# EAGLE schematic test_board_logic3 (EAGLE 9.3.1)
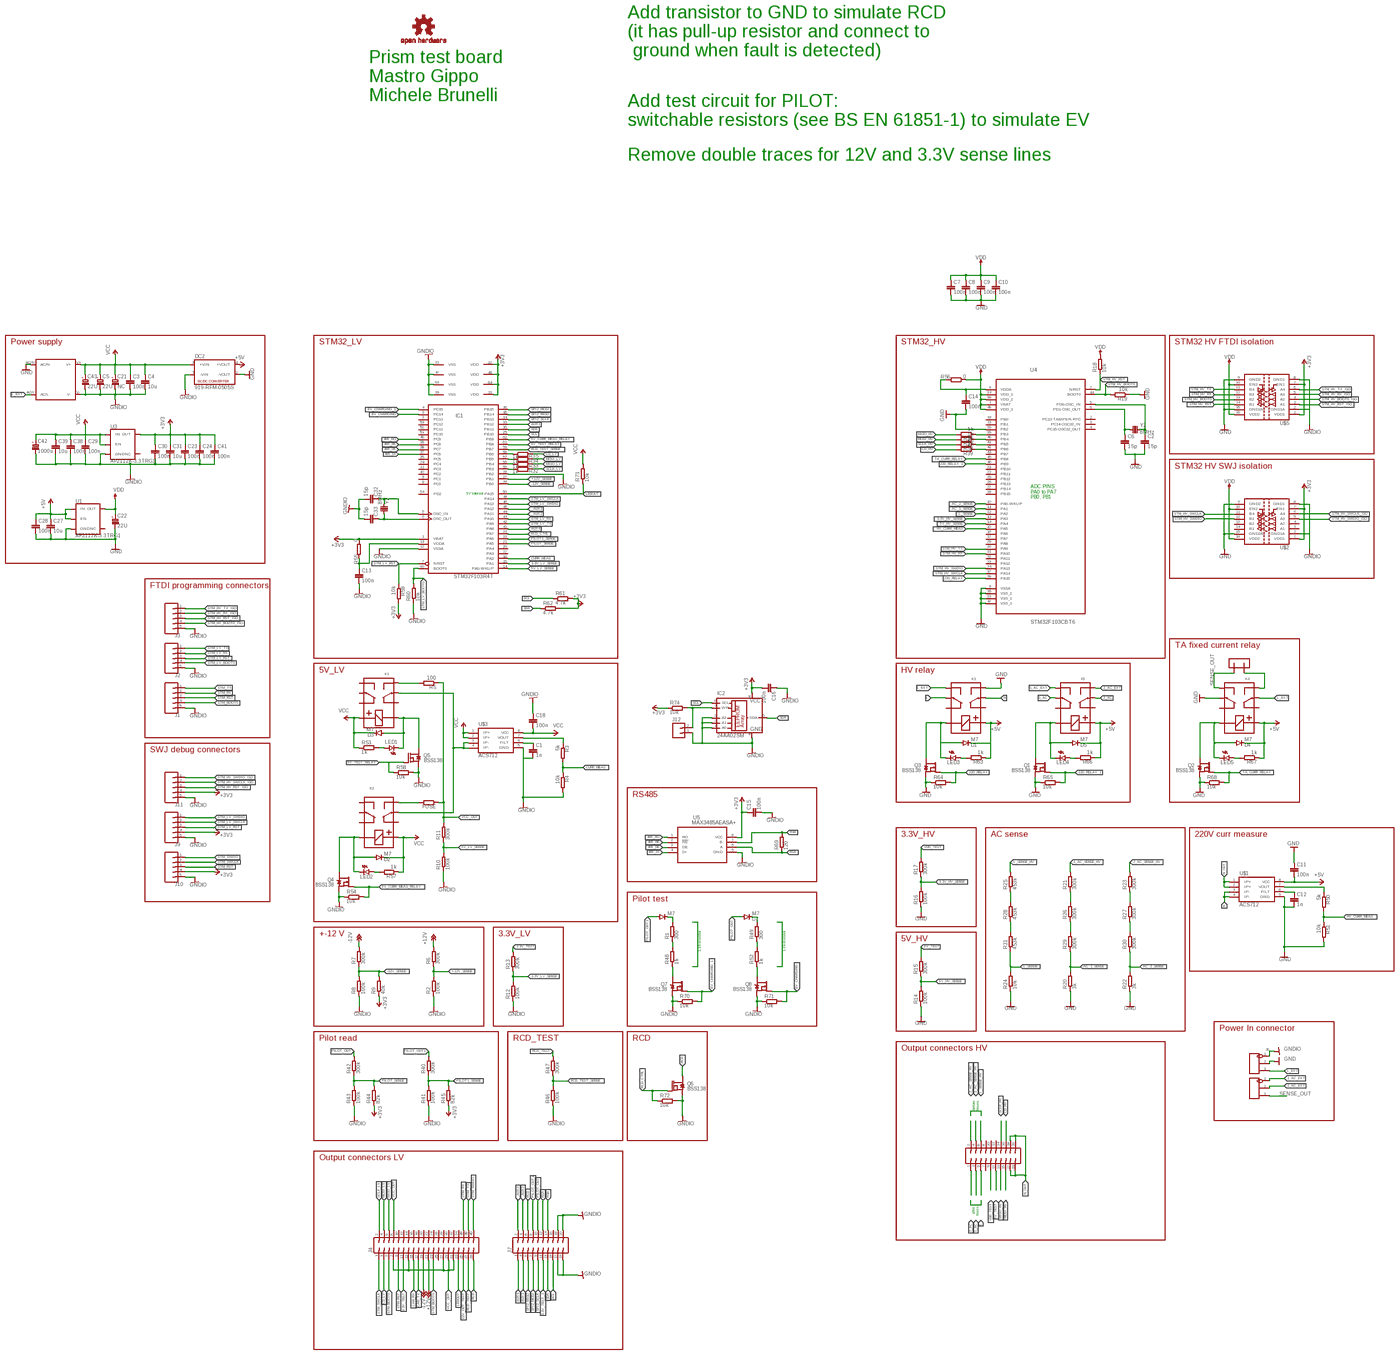
[diagram p0: schematic, sheet 1, overview]
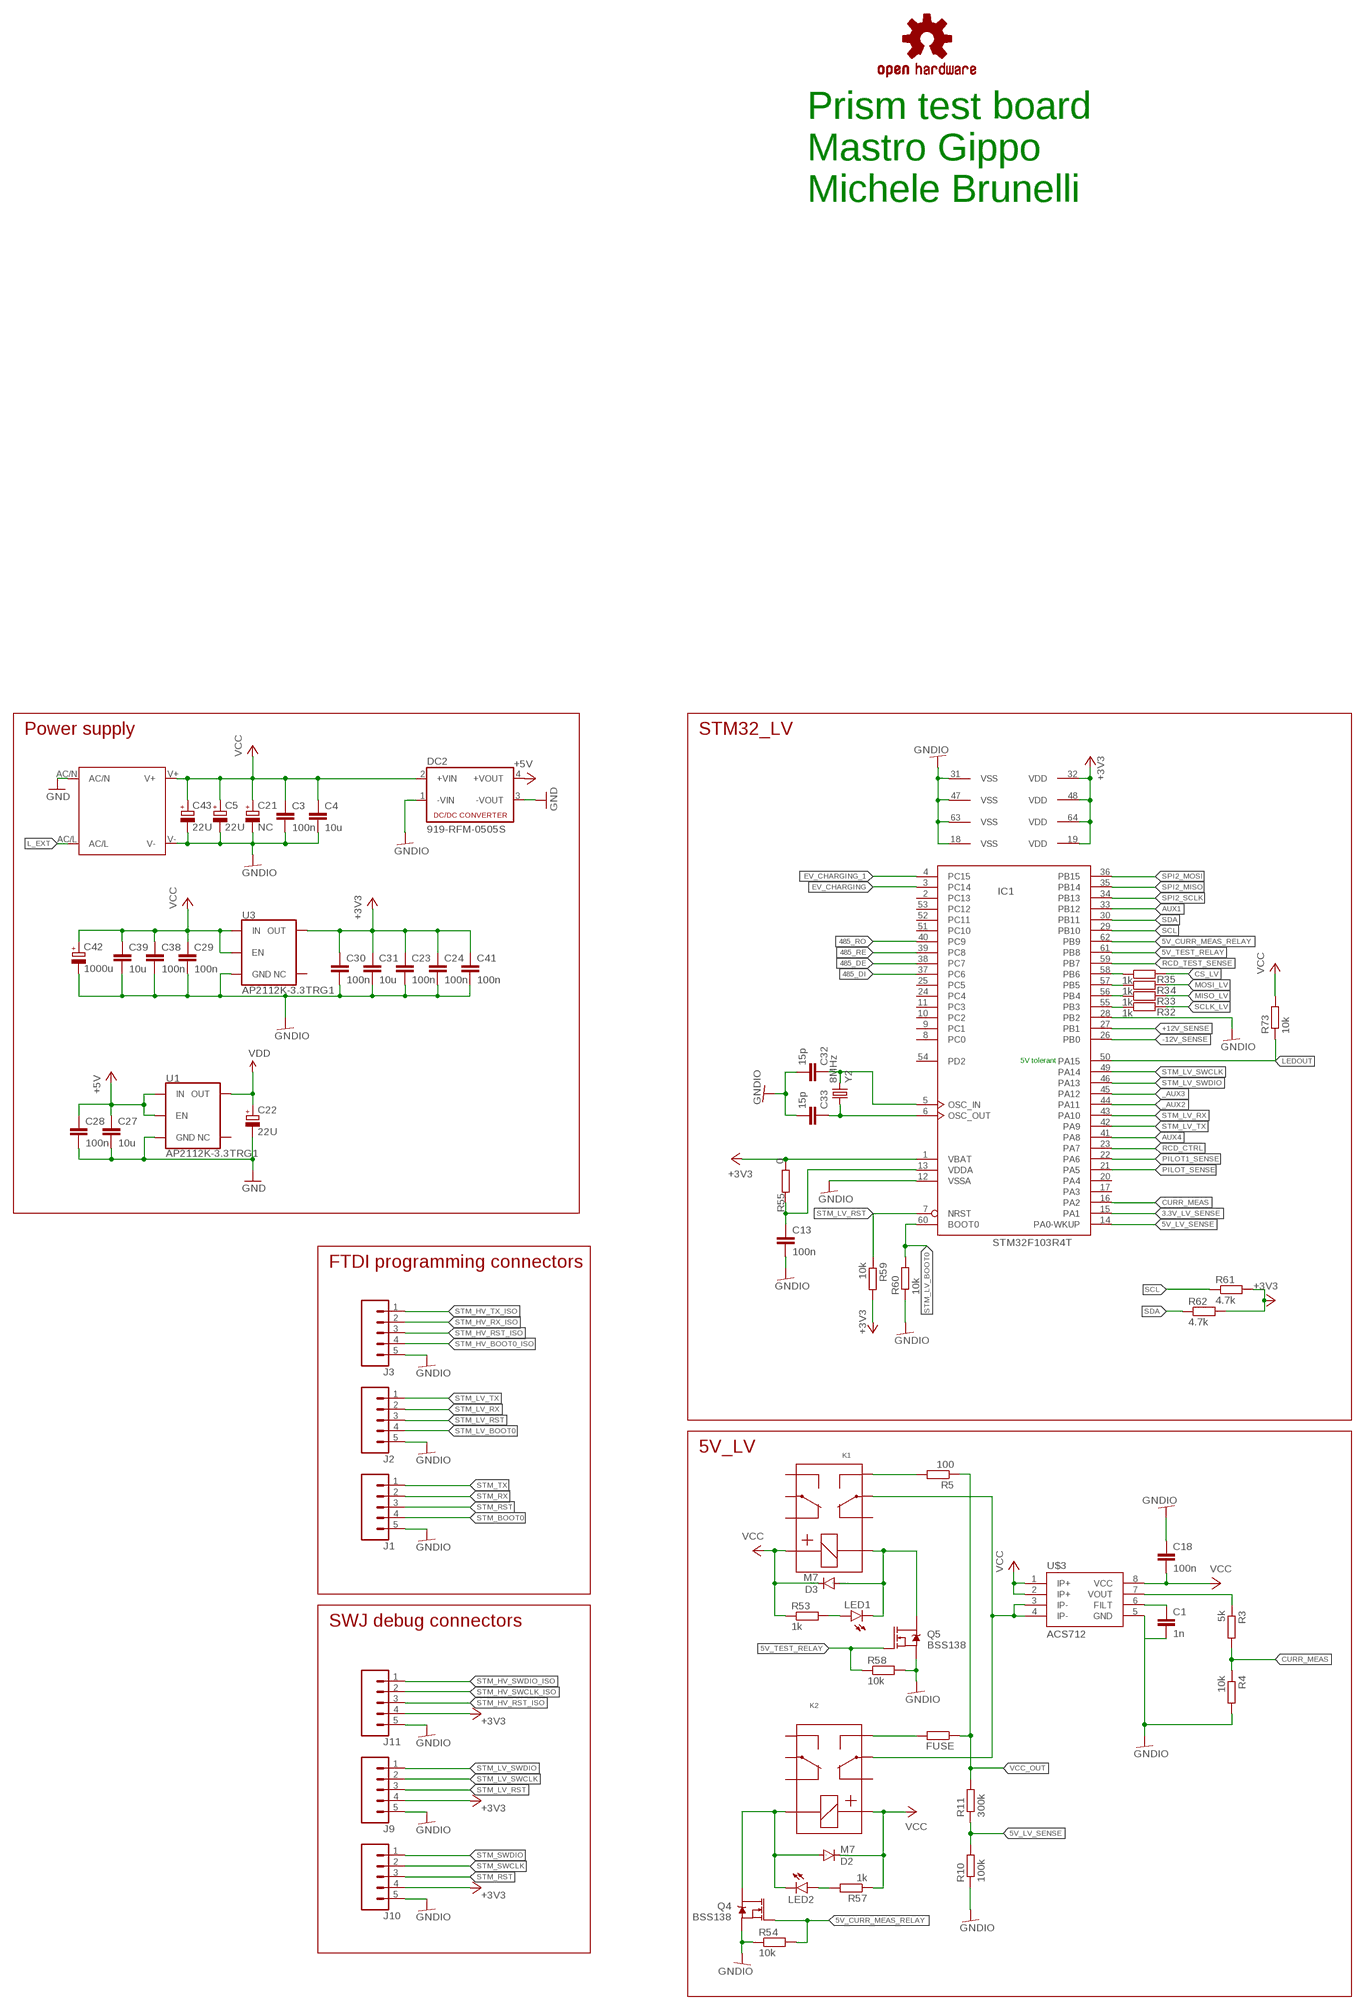
[diagram p1: schematic, sheet 1, part 1 of 4]
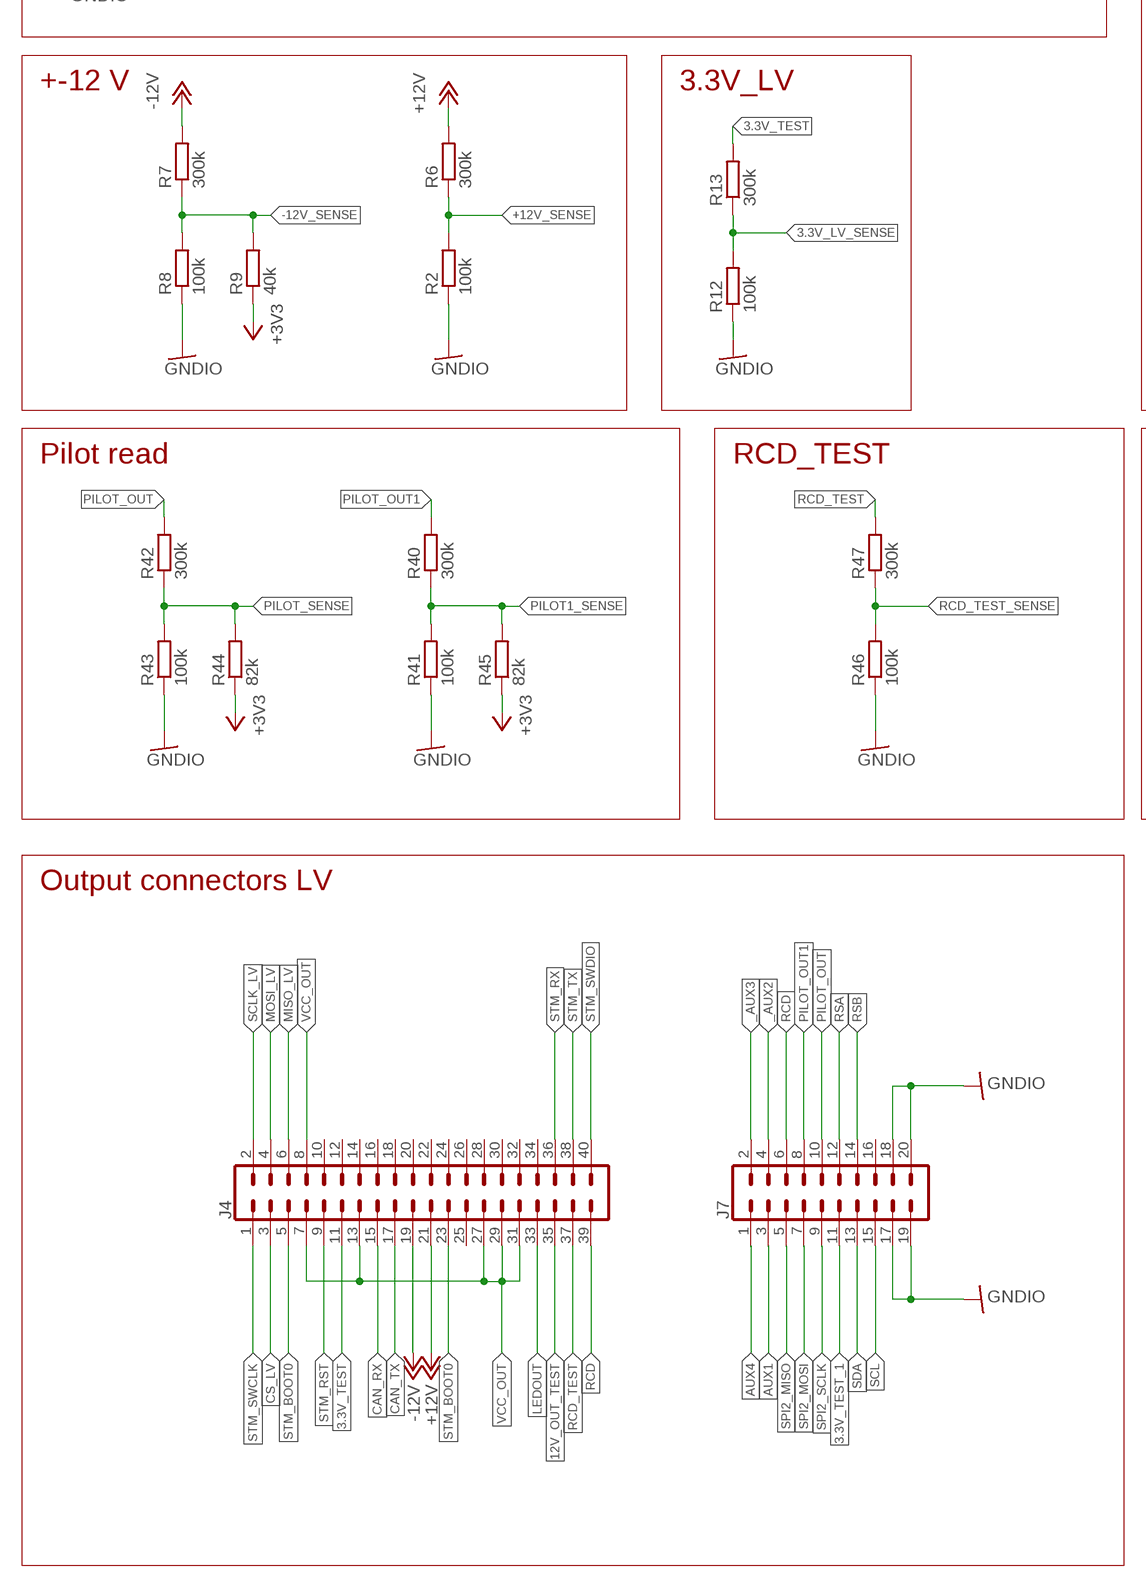
[diagram p2: schematic, sheet 1, part 2 of 4]
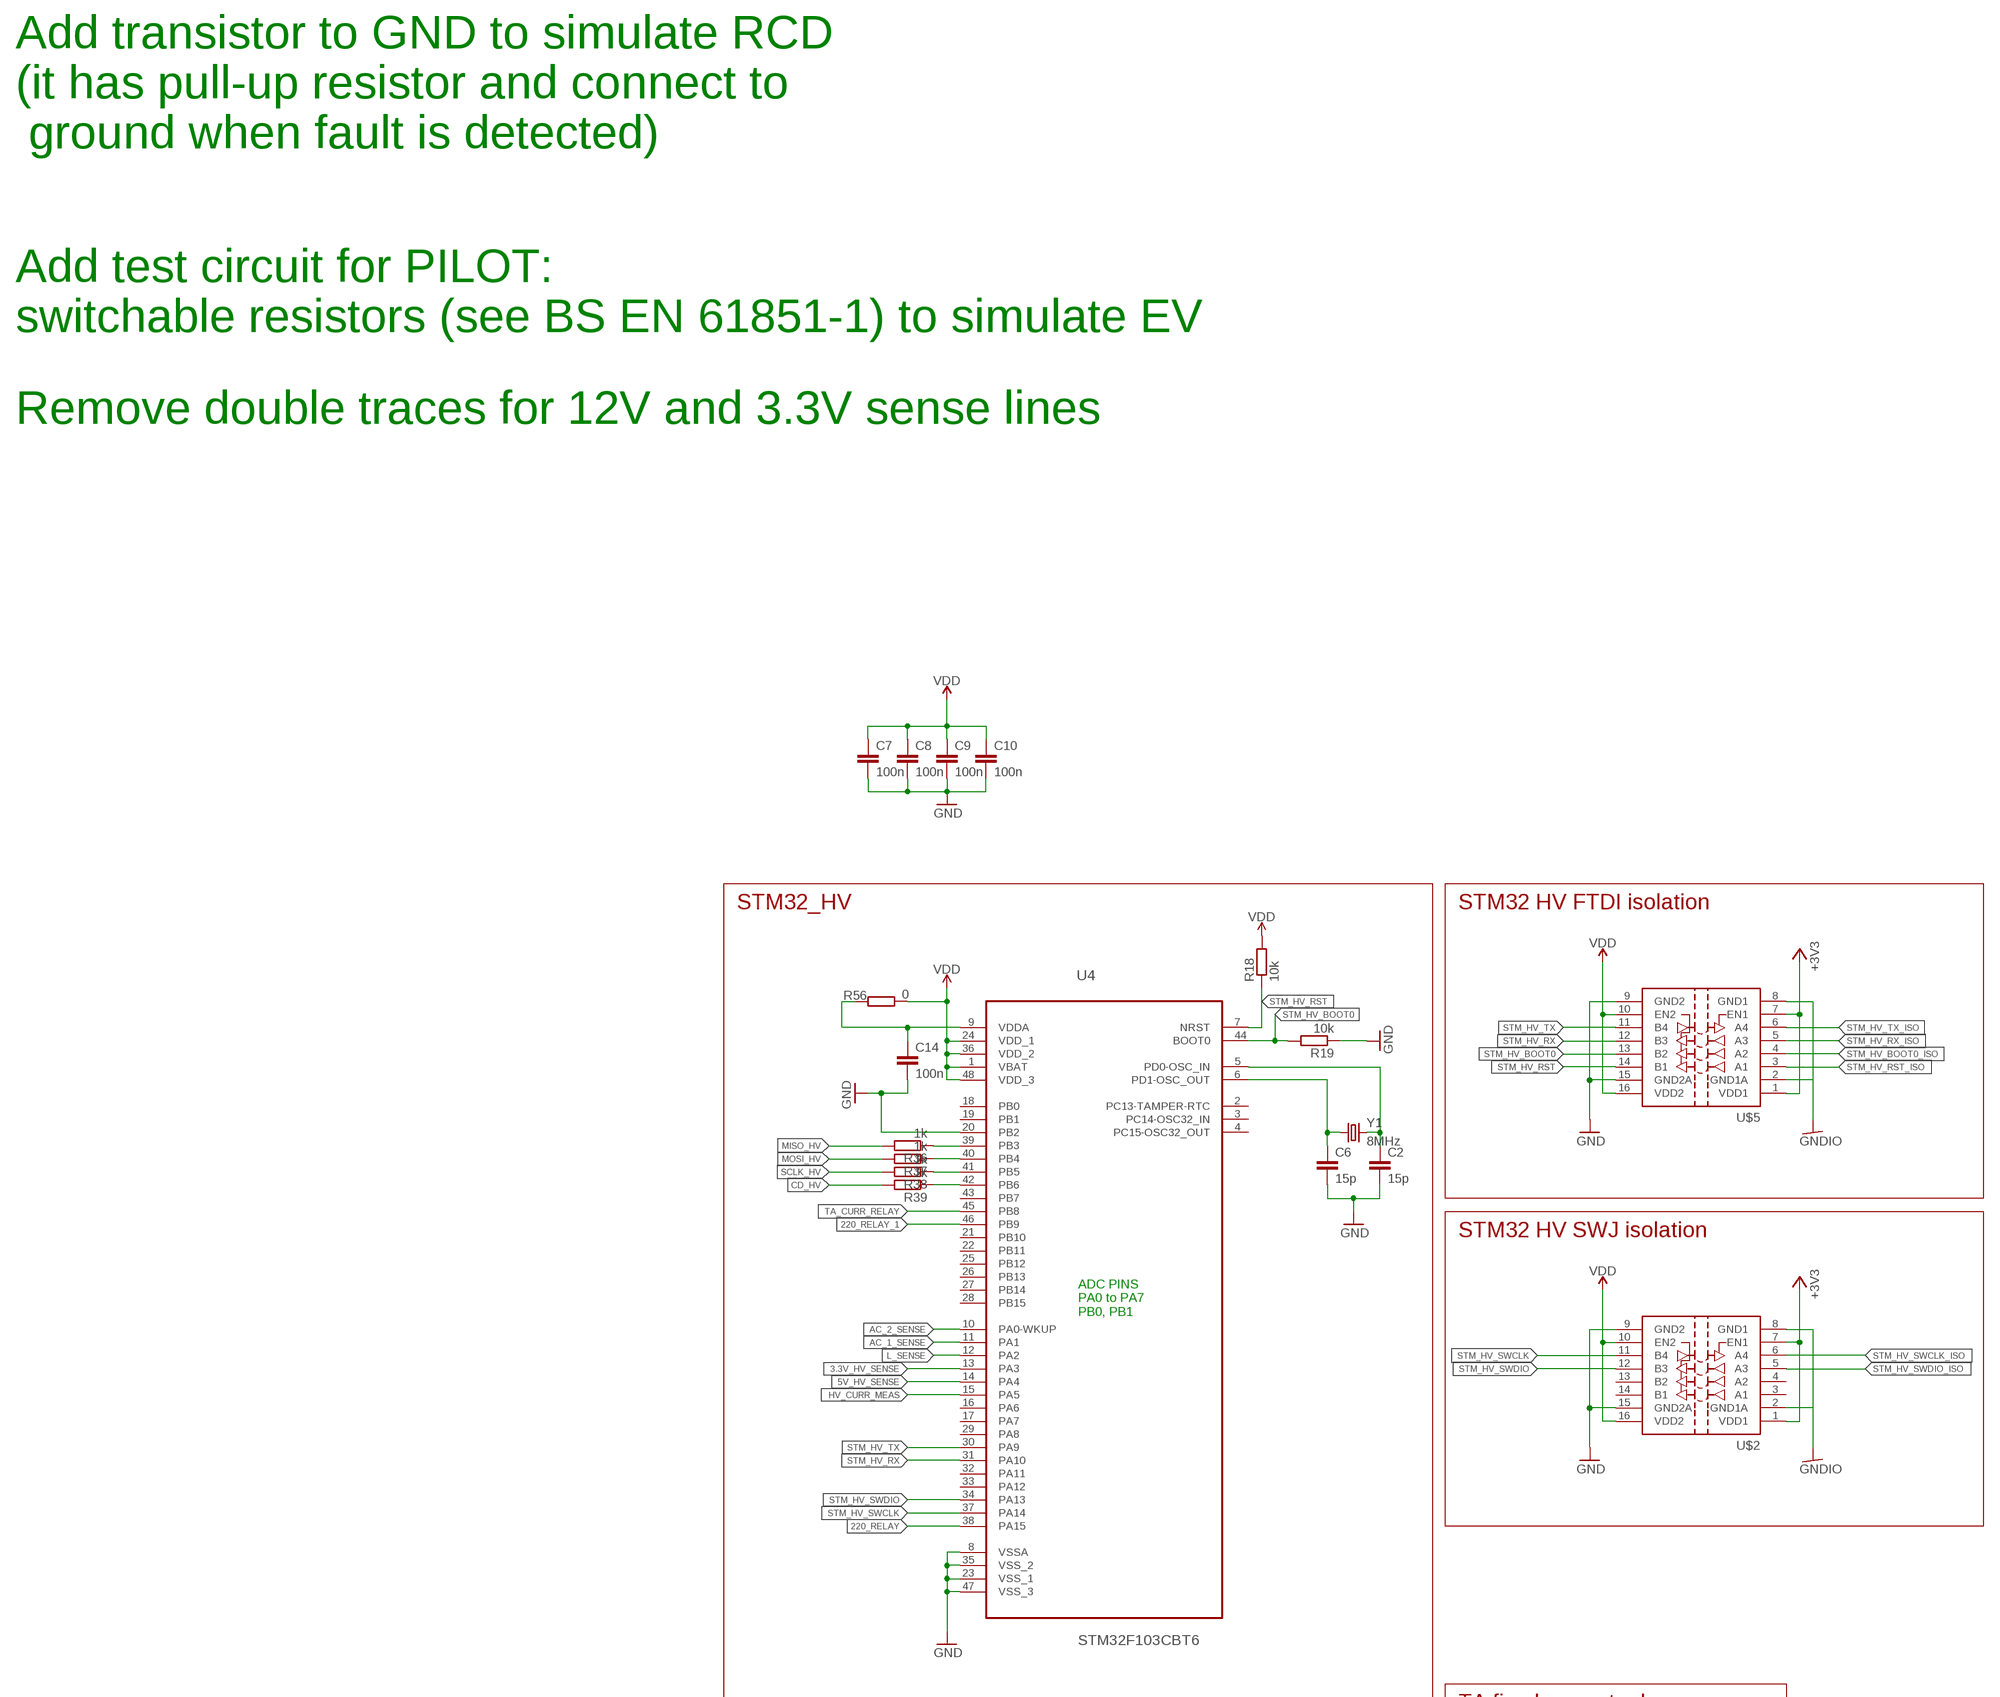
[diagram p3: schematic, sheet 1, part 3 of 4]
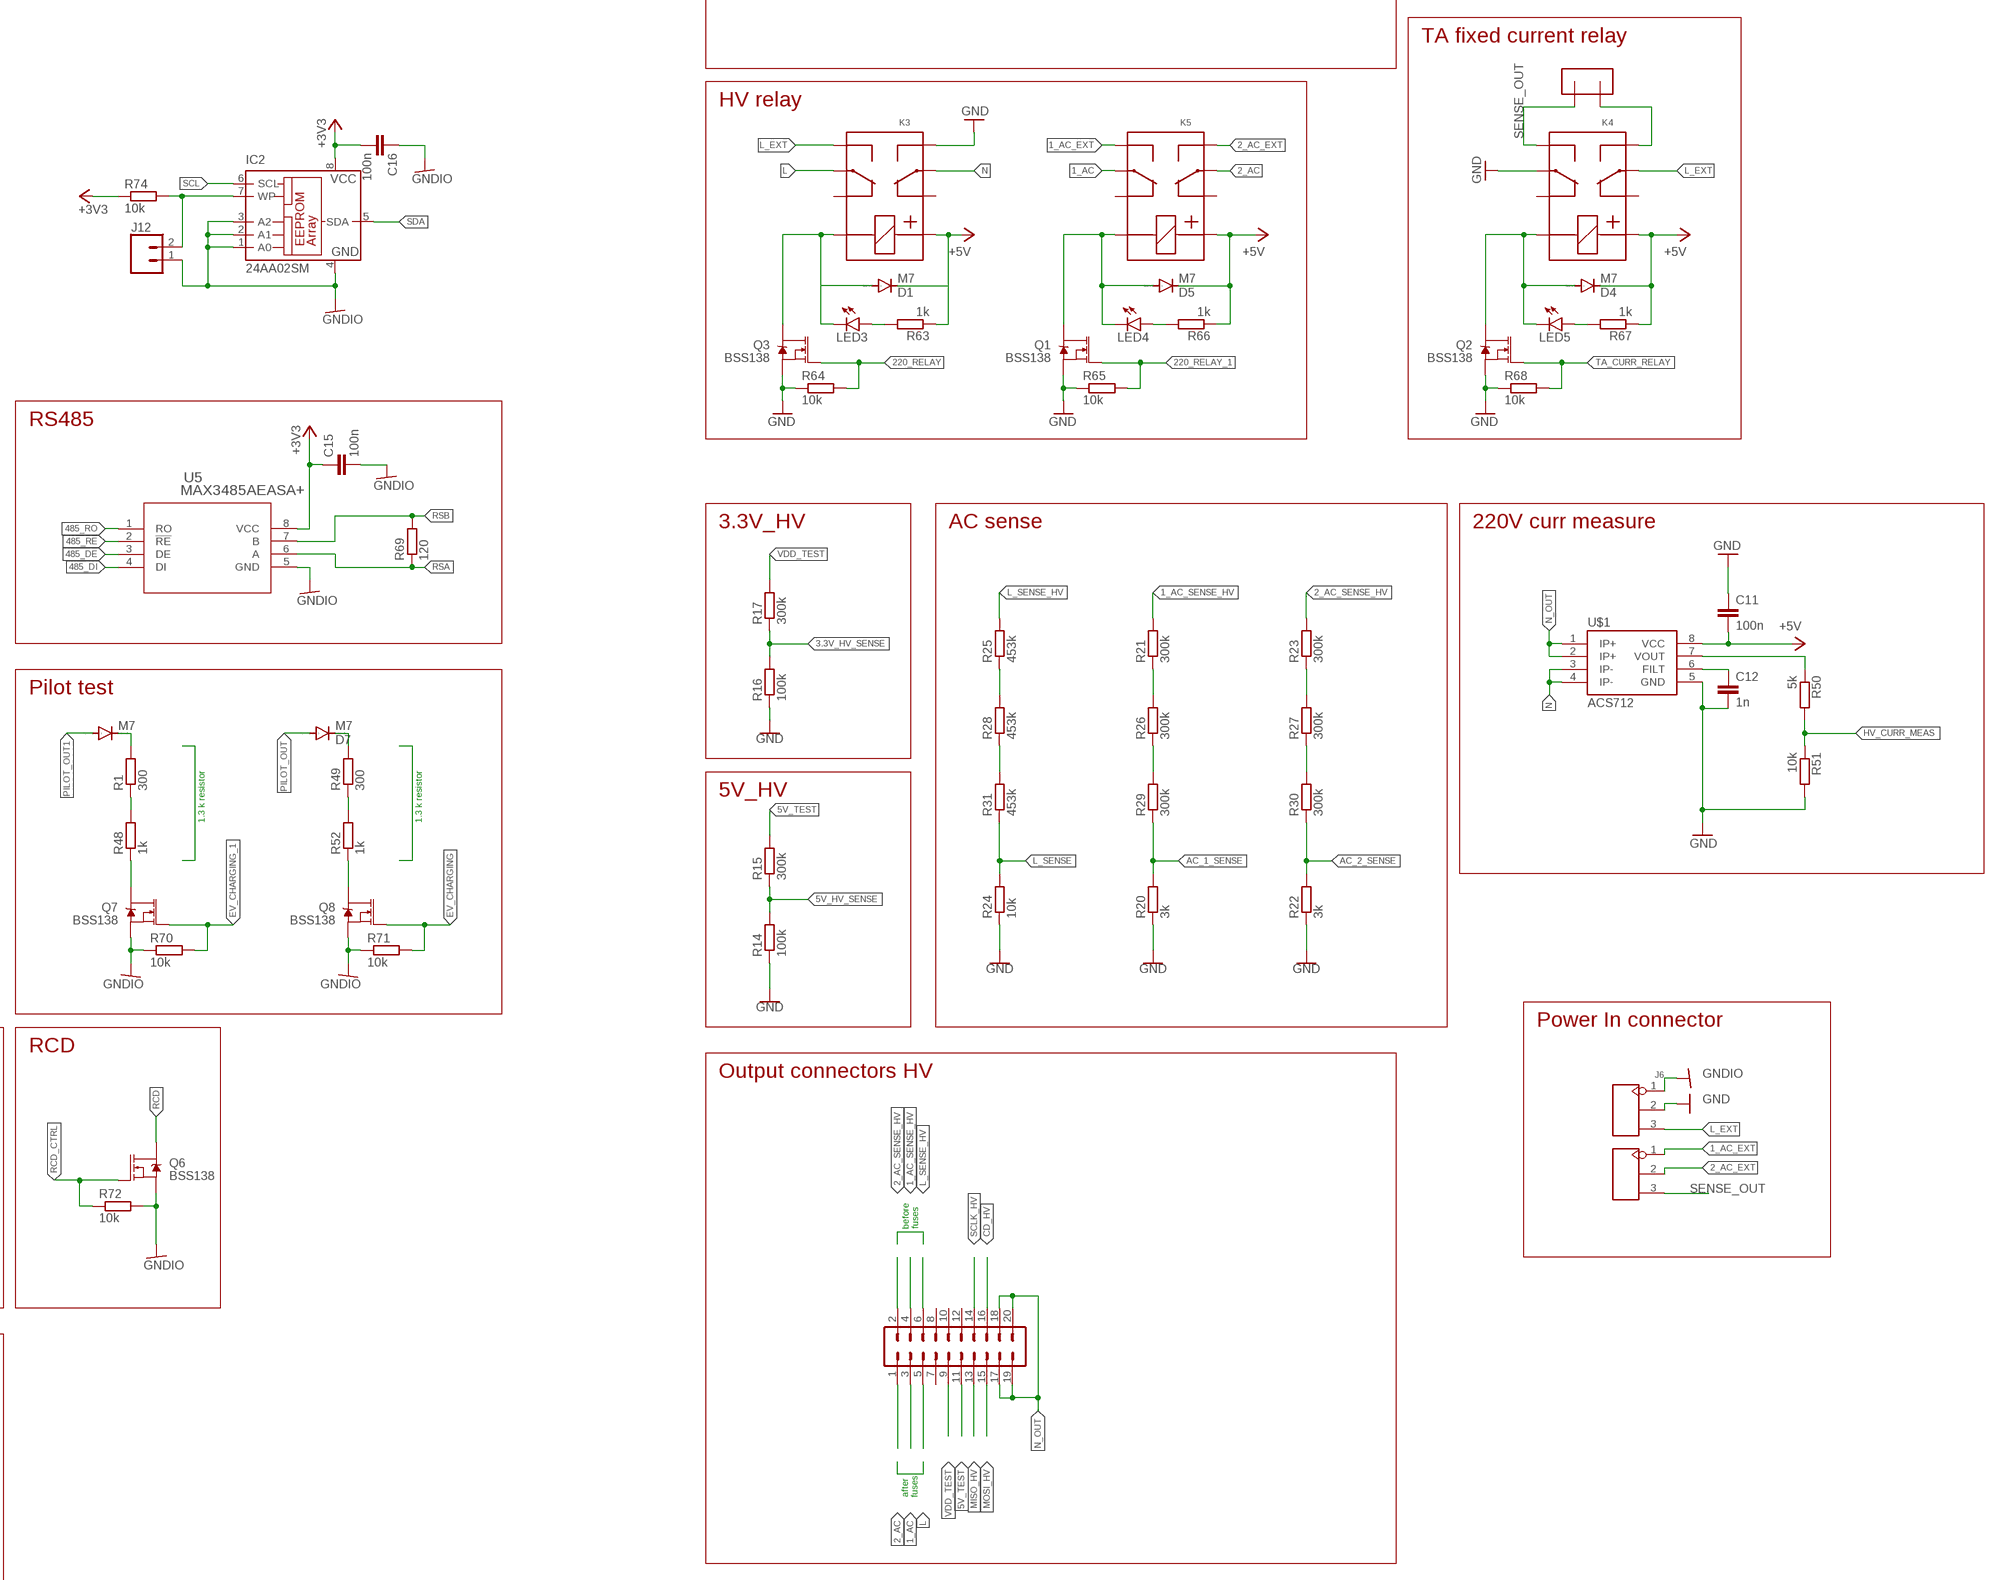
[diagram p4: schematic, sheet 1, part 4 of 4]

## Parts
C1  1n  C-EUC0603K  [C0603K]
C2  15p  C-EUC0603K  [C0603K]
C3  100n  C-EUC0603K  [C0603K]
C4  10u  C-EUC0805K  [C0805K]
C5  22U  CPOL-EUB/3528-21R  [B/3528-21R]
C6  15p  C-EUC0603K  [C0603K]
C7  100n  C-EUC0603K  [C0603K]
C8  100n  C-EUC0603K  [C0603K]
C9  100n  C-EUC0603K  [C0603K]
C10  100n  C-EUC0603K  [C0603K]
C11  100n  C-EUC0603K  [C0603K]
C12  1n  C-EUC0603K  [C0603K]
C13  100n  C-EUC0603K  [C0603K]
C14  100n  C-EUC0603K  [C0603K]
C15  100n  C-EUC0603K  [C0603K]
C16  100n  C-EUC0603K  [C0603K]
C18  100n  C-EUC0603K  [C0603K]
C21  NC  CPOL-EU153CLV-0505  [153CLV-0505]
C22  22U  CPOL-EUB/3528-21R  [B/3528-21R]
C23  100n  C-EUC0603K  [C0603K]
C24  100n  C-EUC0603K  [C0603K]
C27  10u  C-EUC0805K  [C0805K]
C28  100n  C-EUC0603K  [C0603K]
C29  100n  C-EUC0603K  [C0603K]
C30  100n  C-EUC0603K  [C0603K]
C31  10u  C-EUC0805K  [C0805K]
C32  15p  C-EUC0603K  [C0603K]
C33  15p  C-EUC0603K  [C0603K]
C38  100n  C-EUC0603K  [C0603K]
C39  10u  C-EUC0805K  [C0805K]
C41  100n  C-EUC0603K  [C0603K]
C42  1000u  CPOL-EUE5-10.5  [E5-10,5]
C43  22U  CPOL-EUB/3528-21R  [B/3528-21R]
D1  M7  DIODE-DO-214AC  [DO-214AC]
D2  M7  DIODE-DO-214AC  [DO-214AC]
D3  M7  DIODE-DO-214AC  [DO-214AC]
D4  M7  DIODE-DO-214AC  [DO-214AC]
D5  M7  DIODE-DO-214AC  [DO-214AC]
D6  M7  DIODE-DO-214AC  [DO-214AC]
D7  M7  DIODE-DO-214AC  [DO-214AC]
DC2  919-RFM-0505S  NME  [NME]
FUSE  R-EU_R0805  [R0805]
IC1  STM32F103R4T  [LQFP64]
IC2  24AA02SM  [SO-08M]
J1  2001R-5P  CONN_05JST-VERT  [JST-5-PTH-VERT]
J2  2001R-5P  CONN_05JST-VERT  [JST-5-PTH-VERT]
J3  2001R-5P  CONN_05JST-VERT  [JST-5-PTH-VERT]
J4  CONN_20X2SHROUDED  [2X20_SHROUDED]
J5  GREEN-3P-5.0  SCREW-TERMINAL-GREEN(3P-5.0)  [H3-5.0-15.5X8.0MM]
J6  GREEN-3P-5.0  SCREW-TERMINAL-GREEN(3P-5.0)  [H3-5.0-15.5X8.0MM]
J7  CONN_10X2  [2X10]
J8  CONN_10X2  [2X10]
J9  2001R-5P  CONN_05JST-VERT  [JST-5-PTH-VERT]
J10  2001R-5P  CONN_05JST-VERT  [JST-5-PTH-VERT]
J11  2001R-5P  CONN_05JST-VERT  [JST-5-PTH-VERT]
J12  CONN_02  [1X02]
K1  G6S-2  [G6S-2]
K2  G6S-2  [G6S-2]
K3  G6S-2  [G6S-2]
K4  G6S-2  [G6S-2]
K5  G6S-2  [G6S-2]
LED1  LEDSMT1206  [1206]
LED2  LEDSMT1206  [1206]
LED3  LEDSMT1206  [1206]
LED4  LEDSMT1206  [1206]
LED5  LEDSMT1206  [1206]
Q1  BSS138  MOSFET-NCH-BSS138  [SOT23-3]
Q2  BSS138  MOSFET-NCH-BSS138  [SOT23-3]
Q3  BSS138  MOSFET-NCH-BSS138  [SOT23-3]
Q4  BSS138  MOSFET-NCH-BSS138  [SOT23-3]
Q5  BSS138  MOSFET-NCH-BSS138  [SOT23-3]
Q6  BSS138  MOSFET-NCH-BSS138  [SOT23-3]
Q7  BSS138  MOSFET-NCH-BSS138  [SOT23-3]
Q8  BSS138  MOSFET-NCH-BSS138  [SOT23-3]
R1  300  R-EU_R0603  [R0603]
R2  100k  R-EU_R0603  [R0603]
R3  5k  R-EU_R0603  [R0603]
R4  10k  R-EU_R0603  [R0603]
R5  100  R-EU_R1210  [R1210]
R6  300k  R-EU_R0603  [R0603]
R7  300k  R-EU_R0603  [R0603]
R8  100k  R-EU_R0603  [R0603]
R9  40k  R-EU_R0603  [R0603]
R10  100k  R-EU_R0603  [R0603]
R11  300k  R-EU_R0603  [R0603]
R12  100k  R-EU_R0603  [R0603]
R13  300k  R-EU_R0603  [R0603]
R14  100k  R-EU_R0603  [R0603]
R15  300k  R-EU_R0603  [R0603]
R16  100k  R-EU_R0603  [R0603]
R17  300k  R-EU_R0603  [R0603]
R18  10k  R-EU_R0603  [R0603]
R19  10k  R-EU_R0603  [R0603]
R20  3k  R-EU_R0603  [R0603]
R21  300k  R-EU_R0603  [R0603]
R22  3k  R-EU_R0603  [R0603]
R23  300k  R-EU_R0603  [R0603]
R24  10k  R-EU_R0603  [R0603]
R25  453k  R-EU_R0603  [R0603]
R26  300k  R-EU_R0603  [R0603]
R27  300k  R-EU_R0603  [R0603]
R28  453k  R-EU_R0603  [R0603]
R29  300k  R-EU_R0603  [R0603]
R30  300k  R-EU_R0603  [R0603]
R31  453k  R-EU_R0603  [R0603]
R32  1k  R-EU_R0603  [R0603]
R33  1k  R-EU_R0603  [R0603]
R34  1k  R-EU_R0603  [R0603]
R35  1k  R-EU_R0603  [R0603]
R36  1k  R-EU_R0603  [R0603]
R37  1k  R-EU_R0603  [R0603]
R38  1k  R-EU_R0603  [R0603]
R39  1k  R-EU_R0603  [R0603]
R40  300k  R-EU_R0603  [R0603]
R41  100k  R-EU_R0603  [R0603]
R42  300k  R-EU_R0603  [R0603]
R43  100k  R-EU_R0603  [R0603]
R44  82k  R-EU_R0603  [R0603]
R45  82k  R-EU_R0603  [R0603]
R46  100k  R-EU_R0603  [R0603]
R47  300k  R-EU_R0603  [R0603]
R48  1k  R-EU_R0603  [R0603]
R49  300  R-EU_R0603  [R0603]
R50  5k  R-EU_R0603  [R0603]
R51  10k  R-EU_R0603  [R0603]
R52  1k  R-EU_R0603  [R0603]
R53  1k  R-EU_R0603  [R0603]
R54  10k  R-EU_R0603  [R0603]
R55  0  R-EU_R0603  [R0603]
R56  0  R-EU_R0603  [R0603]
R57  1k  R-EU_R0603  [R0603]
R58  10k  R-EU_R0603  [R0603]
R59  10k  R-EU_R0603  [R0603]
R60  10k  R-EU_R0603  [R0603]
R61  4.7k  R-EU_R0603  [R0603]
R62  4.7k  R-EU_R0603  [R0603]
R63  1k  R-EU_R0603  [R0603]
R64  10k  R-EU_R0603  [R0603]
R65  10k  R-EU_R0603  [R0603]
R66  1k  R-EU_R0603  [R0603]
R67  1k  R-EU_R0603  [R0603]
R68  10k  R-EU_R0603  [R0603]
R69  120  R-EU_R0603  [R0603]
R70  10k  R-EU_R0603  [R0603]
R71  10k  R-EU_R0603  [R0603]
R72  10k  R-EU_R0603  [R0603]
R73  10k  R-EU_R0603  [R0603]
R74  10k  R-EU_R0603  [R0603]
U1  AP2112K-3.3TRG1  V_REG_AP2112K-3.3V  [SOT23-5]
U3  AP2112K-3.3TRG1  V_REG_AP2112K-3.3V  [SOT23-5]
U4  STM32F103CBT6  [QFP50P900X900X160-48N]
U5  MAX3485AEASA+  [21-0041B_8]
U$1  ACS712  [SO08]
U$2  SI8441IS1  [SO16]
U$3  ACS712  [SO08]
U$4  NC  IRM_15/20IRM_15/20  [IRM_15/20]
U$5  SI8441IS1  [SO16]
U$6  2 PIN STRIP F  ISOLATED_2P  [STRIP_NOMIDDLE]
U$7  OSHW-LOGOL  [OSHW-LOGO-L]
Y1  8MHz  CRYSTALSMD-3.2X2.5  [CRYSTAL-SMD-3.2X2.5MM]
Y2  8MHz  CRYSTALSMD-3.2X2.5  [CRYSTAL-SMD-3.2X2.5MM]

## Nets
1_AC: J8.3 K5.9
1_AC1: R21.1 R26.2
1_AC2: R26.1 R29.2
1_AC_EXT: J5.1 K5.8
1_AC_SENSE_HV: J8.4 R21.2
2_AC: J8.1 K5.4
2_AC1: R23.1 R27.2
2_AC2: R27.1 R30.2
2_AC_EXT: J5.2 K5.5
2_AC_SENSE_HV: J8.2 R23.2
3.3V_HV_SENSE: R16.2 R17.1 U4.13(PA3)
3.3V_LV_SENSE: IC1.15(PA1) R12.2 R13.1
3.3V_TEST: J4.11 R13.2
3.3V_TEST_1: J7.11
5V_CURR_MEAS_RELAY: IC1.62(PB9) Q4.1(G) R54.2
5V_HV_SENSE: R14.2 R15.1 U4.14(PA4)
5V_LV_SENSE: IC1.14(PA0-WKUP) R10.2 R11.1
5V_TEST: J8.11 R15.2
5V_TEST_RELAY: IC1.61(PB8) Q5.1(G) R58.1
12V_OUT_TEST: J4.35
220_RELAY: Q3.1(G) R64.2 U4.38(PA15)
220_RELAY_1: Q1.1(G) R65.2 U4.46(PB9)
485_DE: IC1.38(PC7) U5.3(DE)
485_DI: IC1.37(PC6) U5.4(DI)
485_RE: IC1.39(PC8) U5.2(!RE)
485_RO: IC1.40(PC9) U5.1(RO)
+3V3: C15.1 C16.2 C23.1 C24.1 C30.1 C31.1 C41.1 IC1.1(VBAT) IC1.19(VDD) IC1.32(VDD) IC1.48(VDD) IC1.64(VDD) IC2.8(VCC) J9.4 J10.4 J11.4 R9.1 R44.1 R45.1 R55.1 R59.2 R61.2 R62.2 R74.1 U3.5(OUT) U5.8(VCC) U$2.1(VDD1) U$2.7(EN1) U$5.1(VDD1) U$5.7(EN1)
+5V: C11.2 C27.1 C28.1 D1.C D4.C D5.C DC2.4(+VOUT) K3.1 K4.1 K5.1 R63.1 R66.1 R67.1 U1.1(IN) U1.3(EN) U$1.8(VCC)
+12V: J4.21 R6.2
+12V_SENSE: IC1.27(PB1) R2.2 R6.1
-12V: J4.19 R7.2
-12V_SENSE: IC1.26(PB0) R7.1 R8.2 R9.2
_AUX2: IC1.44(PA11) J7.4
_AUX3: IC1.45(PA12) J7.2
AC_1_SENSE: R20.2 R29.1 U4.11(PA1)
AC_2_SENSE: R22.2 R30.1 U4.10(PA0-WKUP)
AUX1: IC1.33(PB12) J7.3
AUX4: IC1.41(PA8) J7.1
CAN_RX: J4.15
CAN_TX: J4.17
CD_HV: J8.16 R39.2
CS_LV: J4.3 R35.2
CURR_MEAS: IC1.16(PA2) R3.2 R4.1
EV_CHARGING: IC1.3(PC14) Q8.1(G) R71.2
EV_CHARGING_1: IC1.4(PC15) Q7.1(G) R70.2
GND: C2.2 C6.2 C7.2 C8.2 C9.2 C10.2 C11.1 C12.2 C14.2 C22.- C27.2 C28.2 DC2.3(-VOUT) J6.2 K3.5 K4.9 Q1.2(S) Q2.2(S) Q3.2(S) R14.1 R16.1 R19.1 R20.1 R22.1 R24.1 R51.2 R64.1 R65.1 R68.1 U1.2(GND) U4.8(VSSA) U4.20(PB2) U4.23(VSS_1) U4.35(VSS_2) U4.47(VSS_3) U$1.5(GND) U$2.9(GND2) U$2.15(GND2A) U$4.AC/N U$5.9(GND2) U$5.15(GND2A)
GNDIO: C1.2 C3.2 C4.2 C5.- C13.2 C15.2 C16.1 C18.1 C21.- C23.2 C24.2 C29.2 C30.2 C31.2 C32.2 C33.2 C38.2 C39.2 C41.2 C42.- C43.- DC2.1(-VIN) IC1.12(VSSA) IC1.18(VSS) IC1.28(PB2) IC1.31(VSS) IC1.47(VSS) IC1.63(VSS) IC2.1(A0) IC2.2(A1) IC2.3(A2) IC2.4(GND) J1.5 J2.5 J3.5 J6.1 J7.17 J7.18 J7.19 J7.20 J9.5 J10.5 J11.5 J12.1 Q4.2(S) Q5.2(S) Q6.2(S) Q7.2(S) Q8.2(S) R2.1 R4.2 R8.1 R10.1 R12.1 R41.1 R43.1 R46.1 R54.1 R58.2 R60.1 R70.1 R71.1 R72.2 U3.2(GND) U5.5(GND) U$2.2(GND1A) U$2.8(GND1) U$3.5(GND) U$4.V- U$5.2(GND1A) U$5.8(GND1)
HV_CURR_MEAS: R50.2 R51.1 U4.15(PA5)
L: J8.5 K3.9
L1: R25.1 R28.2
L2: R28.1 R31.2
L_EXT: J6.3 K3.8 K4.4 U$4.AC/L
L_SENSE: R24.2 R31.1 U4.12(PA2)
L_SENSE_HV: J8.6 R25.2
LEDOUT: IC1.50(PA15) J4.33 R73.1
MISO_HV: J8.13 R36.2
MISO_LV: J4.6 R33.2
MOSI_HV: J8.15 R37.2
MOSI_LV: J4.4 R34.2
N: K3.4 U$1.3(IP-) U$1.4(IP-)
N$1: R3.1 U$3.7(VOUT)
N$2: FUSE.2 K2.5
N$3: IC2.7(WP) J12.2 R74.2
N$4: C2.1 U4.5(PD0-OSC_IN) Y1.3
N$5: C1.1 U$3.6(FILT)
N$6: IC1.55(PB3) R32.1
N$7: C6.1 U4.6(PD1-OSC_OUT) Y1.1
N$8: K1.8 R5.2
N$9: IC1.56(PB4) R33.1
N$10: K1.9 K2.4 U$3.3(IP-) U$3.4(IP-)
N$11: C33.1 IC1.6(OSC_OUT) Y2.1
N$12: IC1.57(PB5) R34.1
N$13: IC1.58(PB6) R35.1
N$14: R36.1 U4.39(PB3)
N$15: R37.1 U4.40(PB4)
N$16: R38.1 U4.41(PB5)
N$17: R39.1 U4.42(PB6)
N$18: C12.1 U$1.6(FILT)
N$21: D4.A K4.12 LED5.C Q2.3(D)
N$22: R50.1 U$1.7(VOUT)
N$23: K4.5 U$6.P$1
N$24: D1.A K3.12 LED3.C Q3.3(D)
N$25: D5.A K5.12 LED4.C Q1.3(D)
N$26: D2.A K2.12 LED2.C Q4.3(D)
N$27: D3.A K1.12 LED1.C Q5.3(D)
N$28: C13.1 IC1.13(VDDA) R55.2
N$29: C14.1 R56.2 U4.9(VDDA)
N$30: D6.C R1.2
N$31: Q7.3(D) R48.1
N$32: R49.1 R52.2
N$34: Q8.3(D) R52.1
N$36: R1.1 R48.2
N$37: LED1.A R53.2
N$38: LED5.A R67.2
N$39: LED2.A R57.2
N$40: LED3.A R63.2
N$42: LED4.A R66.2
N$43: D7.C R49.2
N$44: C32.1 IC1.5(OSC_IN) Y2.3
N_OUT: J8.17 J8.18 J8.19 J8.20 U$1.1(IP+) U$1.2(IP+)
PILOT1_SENSE: IC1.22(PA6) R40.1 R41.2 R45.2
PILOT_OUT: D7.A J7.10 R42.2
PILOT_OUT1: D6.A J7.8 R40.2
PILOT_SENSE: IC1.21(PA5) R42.1 R43.2 R44.2
RCD: J4.39 J7.6 Q6.3(D)
RCD_CTRL: IC1.23(PA7) Q6.1(G) R72.1
RCD_TEST: J4.37 R47.2
RCD_TEST_SENSE: IC1.59(PB7) R46.2 R47.1
RSA: J7.12 R69.1 U5.6(A)
RSB: J7.14 R69.2 U5.7(B)
SCL: IC1.29(PB10) IC2.6(SCL) J7.15 R61.1
SCLK_HV: J8.14 R38.2
SCLK_LV: J4.2 R32.2
SDA: IC1.30(PB11) IC2.5(SDA) J7.13 R62.1
SENSE_OUT: J5.3 K4.8 U$6.P$2
SPI2_MISO: IC1.35(PB14) J7.5
SPI2_MOSI: IC1.36(PB15) J7.7
SPI2_SCLK: IC1.34(PB13) J7.9
STM_BOOT0: J1.4 J4.5 J4.23
STM_HV_BOOT0: R19.2 U4.44(BOOT0) U$5.13(B2)
STM_HV_BOOT0_ISO: J3.4 U$5.4(A2)
STM_HV_RST: R18.1 U4.7(NRST) U$5.14(B1)
STM_HV_RST_ISO: J3.3 J11.3 U$5.3(A1)
STM_HV_RX: U4.31(PA10) U$5.12(B3)
STM_HV_RX_ISO: J3.2 U$5.5(A3)
STM_HV_SWCLK: U4.37(PA14) U$2.11(B4)
STM_HV_SWCLK_ISO: J11.2 U$2.6(A4)
STM_HV_SWDIO: U4.34(PA13) U$2.12(B3)
STM_HV_SWDIO_ISO: J11.1 U$2.5(A3)
STM_HV_TX: U4.30(PA9) U$5.11(B4)
STM_HV_TX_ISO: J3.1 U$5.6(A4)
STM_LV_BOOT0: IC1.60(BOOT0) J2.4 R60.2
STM_LV_RST: IC1.7(NRST) J2.3 J9.3 R59.1
STM_LV_RX: IC1.43(PA10) J2.2
STM_LV_SWCLK: IC1.49(PA14) J9.2
STM_LV_SWDIO: IC1.46(PA13) J9.1
STM_LV_TX: IC1.42(PA9) J2.1
STM_RST: J1.3 J4.9 J10.3
STM_RX: J1.2 J4.36
STM_SWCLK: J4.1 J10.2
STM_SWDIO: J4.40 J10.1
STM_TX: J1.1 J4.38
TA_CURR_RELAY: Q2.1(G) R68.2 U4.45(PB8)
VCC: C3.1 C4.1 C5.+ C18.2 C21.+ C29.1 C38.1 C39.1 C42.+ C43.+ D2.C D3.C DC2.2(+VIN) K1.1 K2.1 R53.1 R57.1 R73.2 U3.1(IN) U3.3(EN) U$3.1(IP+) U$3.2(IP+) U$3.8(VCC) U$4.V+
VCC_OUT: FUSE.1 J4.7 J4.8 J4.13 J4.27 J4.29 J4.31 R5.1 R11.2
VDD: C7.1 C8.1 C9.1 C10.1 C22.+ R18.2 R56.1 U1.5(OUT) U4.1(VBAT) U4.24(VDD_1) U4.36(VDD_2) U4.48(VDD_3) U$2.10(EN2) U$2.16(VDD2) U$5.10(EN2) U$5.16(VDD2)
VDD_TEST: J8.9 R17.2
Unconnected: IC1.2(PC13) IC1.8(PC0) IC1.9(PC1) IC1.10(PC2) IC1.11(PC3) IC1.17(PA3) IC1.20(PA4) IC1.24(PC4) IC1.25(PC5) IC1.51(PC10) IC1.52(PC11) IC1.53(PC12) IC1.54(PD2) J4.10 J4.12 J4.14 J4.16 J4.18 J4.20 J4.22 J4.24 J4.25 J4.26 J4.28 J4.30 J4.32 J4.34 J7.16 J8.7 J8.8 J8.10 J8.12 K1.3 K1.4 K1.5 K1.10 K2.3 K2.8 K2.9 K2.10 K3.3 K3.10 K4.3 K4.10 K5.3 K5.10 U1.4(NC) U3.4(NC) U4.2(PC13-TAMPER-RTC) U4.3(PC14-OSC32_IN) U4.4(PC15-OSC32_OUT) U4.16(PA6) U4.17(PA7) U4.18(PB0) U4.19(PB1) U4.21(PB10) U4.22(PB11) U4.25(PB12) U4.26(PB13) U4.27(PB14) U4.28(PB15) U4.29(PA8) U4.33(PA12) U4.43(PB7) U$2.3(A1) U$2.4(A2) U$2.13(B2) U$2.14(B1)

## Notes on the sheet
- Add transistor to GND to simulate RCD 
  (it has pull-up resistor and connect to
   ground when fault is detected)
- Prism test board
  Mastro Gippo
  Michele Brunelli
- Add test circuit for PILOT:
  switchable resistors (see BS EN 61851-1) to simulate EV
- Remove double traces for 12V and 3.3V sense lines
- Power supply | STM32_LV | STM32_HV | STM32 HV FTDI isolation
- STM32 HV SWJ isolation
- 5V tolerant
- ADC PINS
  PA0 to PA7
  PB0, PB1
- FTDI programming connectors
- TA fixed current relay
- 5V_LV | HV relay
- SWJ debug connectors
- RS485
- 3.3V_HV | AC sense | 220V curr measure
- Pilot test
- +-12 V | 3.3V_LV
- 5V_HV
- 1.3 k resistor | 1.3 k resistor
- Power In connector
- Pilot read | RCD_TEST | RCD
- Output connectors HV
- before
  fuses
- Output connectors LV
- after 
  fuses

## Power pins joined to a net without a drawn wire
PA11: U4.32(PA11)

## Library data of the parts
C1-C3 C6-C16 C18 C23 C24 C28-C30 C32 C33 C38 C41 = rcl:C-EU: CAPACITOR, European symbol; SPICEPREFIX: C
C4 C27 C31 C39 = resistor:C-EU: CAPACITOR, European symbol
C5 C21 C22 C42 C43 = rcl:CPOL-EU: POLARIZED CAPACITOR, European symbol; SPICEPREFIX: C
D1-D7 = diode:DIODE-: DIODE
DC2 = dc-dc-converter:NME: DC-DC CONVERTER; MF: C & D TECHNOLOGIES, INC; MPN: NME1205D; OC_FARNELL: 1021466; OC_NEWARK: 98B8198
FUSE R1-R74 = rcl:R-EU_: RESISTOR, European symbol; SPICEPREFIX: R
IC1 = micro-stm_v2:STM32F103R*T: ARM 32-bit Cortex™-M3 CPU 72 MHz maximum frequency 16 to 1024 Kbytes of Flash memory 6 to 96 kbytes of SRAM 51 GPIOs 2.0 to 3.6 V application supply
IC2 = microchip:24*: Serial EEPROM I2C; MF: MICROCHIP; MPN: 24AA02-I/SN; OC_FARNELL: 1331272; OC_NEWARK: 92C6803
J1-J3 J9-J11 = SparkFun-Connectors:CONN_05: Multi connection point. Often used as Generic Header-pin footprint for 0.1 inch spaced/style header connections On any of the 0.1 inch spaced packages, you can populate with these: Break Away Headers - Straight <https://www.sparkfun.com/products/116> (PRT-00116) Break Away Male Headers - Right Angle <https://www.sparkfun.com/products/553> (PRT-00553) Female Headers <https://www.sparkfun.com/products/115> (PRT-00115) Break Away Headers - Machine Pin <https://www.sparkfun.com/products/117> (PRT-00117) Break Away Female Headers - Swiss Machine Pin <https://www.sparkfun.com/products/743> (PRT-00743) For SCREWTERMINALS and SPRING TERMINALS visit here: Screw Terimnals on SparkFun.com <https://www.sparkfun.com/search/results?term=Screw+Terminals> (5mm/3.5mm/2.54mm spacing) This device is also useful as a general connection point to wire up your design to another part of your project. Our various solder wires solder well into these plated through hole pads. Hook-Up Wire - Assortment (Stranded, 22 AWG) <https://www.sparkfun.com/products/11375> (PRT-11375) Hook-Up Wire - Assortment (Solid Core, 22 AWG) <https://www.sparkfun.com/products/11367> (PRT-11367) View the entire wire category on our website here <https://www.sparkfun.com/categories/141> Special notes: Molex polarized connector foot print use with SKU : PRT-08231 with associated crimp pins and housings. 1MM SMD Version SKU: PRT-10208
J4 = SparkFun-Connectors:CONN_20X2: Multi connection point. Often used as Generic Header-pin footprint for 0.1 inch spaced/style header connections On any of the 0.1 inch spaced packages, you can populate with these: Break Away Headers - Straight <https://www.sparkfun.com/products/116> (PRT-00116) Break Away Male Headers - Right Angle <https://www.sparkfun.com/products/553> (PRT-00553) Female Headers <https://www.sparkfun.com/products/115> (PRT-00115) Break Away Headers - Machine Pin <https://www.sparkfun.com/products/117> (PRT-00117) Break Away Female Headers - Swiss Machine Pin <https://www.sparkfun.com/products/743> (PRT-00743); PROD_ID: CONN-12263; SF_ID: CONN-12263
J5 J6 = Seeed-Connector:SCREW-TERMINAL-GREEN(3P-5.0): 320110029
J7 J8 = SparkFun-Connectors:CONN_10X2: Multi connection point. Often used as Generic Header-pin footprint for 0.1 inch spaced/style header connections On any of the 0.1 inch spaced packages, you can populate with these: Break Away Headers - Straight <https://www.sparkfun.com/products/116> (PRT-00116) Break Away Male Headers - Right Angle <https://www.sparkfun.com/products/553> (PRT-00553) Female Headers <https://www.sparkfun.com/products/115> (PRT-00115) Break Away Headers - Machine Pin <https://www.sparkfun.com/products/117> (PRT-00117) Break Away Female Headers - Swiss Machine Pin <https://www.sparkfun.com/products/743> (PRT-00743) Special note about the "SPECIAL" package: This was SPECIALLY designed to be used with our Graphic LCD Backpack. Be sure you want to use this! It is not only staggered on each line of header holes, but IT IS ALSO offset of the center point of the top and bottom lines by 5 mil. This causes the headers to lock into place on the "standard" footprint on the LCD screen. The extra squares on the tdocu layer are there simply to reference other pins (if you were to actually populate a longer header than ten long - this is what we do with the backpacks).
J12 = SparkFun-Connectors:CONN_02: Multi connection point. Often used as Generic Header-pin footprint for 0.1 inch spaced/style header connections On any of the 0.1 inch spaced packages, you can populate with these: Break Away Headers - Straight <https://www.sparkfun.com/products/116> (PRT-00116) Break Away Male Headers - Right Angle <https://www.sparkfun.com/products/553> (PRT-00553) Female Headers <https://www.sparkfun.com/products/115> (PRT-00115) Break Away Headers - Machine Pin <https://www.sparkfun.com/products/117> (PRT-00117) Break Away Female Headers - Swiss Machine Pin <https://www.sparkfun.com/products/743> (PRT-00743) For SCREWTERMINALS and SPRING TERMINALS visit here: Screw Terimnals on SparkFun.com <https://www.sparkfun.com/search/results?term=Screw+Terminals> (5mm/3.5mm/2.54mm spacing) This device is also useful as a general connection point to wire up your design to another part of your project. Our various solder wires solder well into these plated through hole pads. Hook-Up Wire - Assortment (Stranded, 22 AWG) <https://www.sparkfun.com/products/11375> (PRT-11375) Hook-Up Wire - Assortment (Solid Core, 22 AWG) <https://www.sparkfun.com/products/11367> (PRT-11367) View the entire wire category on our website here <https://www.sparkfun.com/categories/141> Special notes: Molex polarized connector foot print use with: PRT-08233 with associated crimp pins and housings. 2.54_SCREWTERM for use with PRT-10571. 3.5mm Screw Terminal footprints for PRT-08084 5mm Screw Terminal footprints for use with PRT-08432
K1-K5 = Brunez:G6S-2: RELAY 2 x switch, Omron; OC_FARNELL: unknown; OC_NEWARK: unknown
LED1-LED5 = led:LED: LED OSRAM: - CHIPLED LG R971, LG N971, LY N971, LG Q971, LY Q971, LO R971, LY R971 LH N974, LH R974 LS Q976, LO Q976, LY Q976 LO Q996 - Hyper CHIPLED LW Q18S LB Q993, LB Q99A, LB R99A - SideLED LS A670, LO A670, LY A670, LG A670, LP A670 LB A673, LV A673, LT A673, LW A673 LH A674 LY A675 LS A676, LA A676, LO A676, LY A676, LW A676 LS A679, LY A679, LG A679 - Hyper Micro SIDELED® LS Y876, LA Y876, LO Y876, LY Y876 LT Y87S - SmartLED LW L88C, LW L88S LB L89C, LB L89S, LG L890 LS L89K, LO L89K, LY L89K LS L896, LA L896, LO L896, LY L896 - TOPLED LS T670, LO T670, LY T670, LG T670, LP T670 LSG T670, LSP T670, LSY T670, LOP T670, LYG T670 LG T671, LOG T671, LSG T671 LB T673, LV T673, LT T673, LW T673 LH T674 LS T676, LA T676, LO T676, LY T676, LB T676, LH T676, LSB T676, LW T676 LB T67C, LV T67C, LT T67C, LS T67K, LO T67K, LY T67K, LW E67C LS E67B, LA E67B, LO E67B, LY E67B, LB E67C, LV E67C, LT E67C LW T67C LS T679, LY T679, LG T679 LS T770, LO T770, LY T770, LG T770, LP T770 LB T773, LV T773, LT T773, LW T773 LH T774 LS E675, LA E675, LY E675, LS T675 LS T776, LA T776, LO T776, LY T776, LB T776 LHGB T686 LT T68C, LB T68C - Hyper Mini TOPLED® LB M676 - Mini TOPLED Santana® LG M470 LS M47K, LO M47K, LY M47K Source: http://www.osram.convergy.de LUXEON: - LUMILED® LXK2-PW12-R00, LXK2-PW12-S00, LXK2-PW14-U00, LXK2-PW14-V00 LXK2-PM12-R00, LXK2-PM12-S00, LXK2-PM14-U00 LXK2-PE12-Q00, LXK2-PE12-R00, LXK2-PE12-S00, LXK2-PE14-T00, LXK2-PE14-U00 LXK2-PB12-K00, LXK2-PB12-L00, LXK2-PB12-M00, LXK2-PB14-N00, LXK2-PB14-P00, LXK2-PB14-Q00 LXK2-PR12-L00, LXK2-PR12-M00, LXK2-PR14-Q00, LXK2-PR14-R00 LXK2-PD12-Q00, LXK2-PD12-R00, LXK2-PD12-S00 LXK2-PH12-R00, LXK2-PH12-S00 LXK2-PL12-P00, LXK2-PL12-Q00, LXK2-PL12-R00 Source: www.luxeon.com KINGBRIGHT: KA-3528ASYC Source: www.kingbright.com
Q1-Q8 = SparkFun-DiscreteSemi:MOSFET-NCH: N-channel MOSFETs Voltage controlled devices that allow control of high current outputs. SparkFun Products: SparkFun OpenScale <https://www.sparkfun.com/products/13261> SparkFun Digital Sandbox <https://www.sparkfun.com/products/12651> SparkFun Monster Moto Shield <https://www.sparkfun.com/products/10182> SparkFun MOSFET Power Controller <https://www.sparkfun.com/products/11214>; PROD_ID: TRANS-00830; VALUE: 220mA/50V/3.5Ω
U1 U3 = SparkFun-IC-Power:V_REG_AP2112: AP2112 - 600mA CMOS LDO Regulator w/ Enable The AP2112 is CMOS process low dropout linear regulator with enable function, the regulator delivers a guaranteed 600mA (min.) continuous load current. Features Output Voltage Accuracy: ±1.5% Output Current: 600mA (Min.) Foldback Short Current Protection: 50mA Enable Function to Turn ON/OFF VOUT Low Dropout Voltage (3.3V): 250mV (Typ.) @IOUT=600mA Excellent Load Regulation: 0.2%/A (Typ.) Excellent Line Regulation: 0.02%/V (Typ.) Low Quiescent Current: 55μA (Typ.) Low Standby Current: 0.01μA (Typ.) Low Output Noise: 50μVRMS PSRR: 100Hz -65dB, 1kHz -65dB OTSD Protection Stable with 1.0μF Flexible Cap: Ceramic, Tantalum and Aluminum Electrolytic Operation Temperature Range: -40°C to 85°C ESD: MM 400V, HBM 4000V; PROD_ID: VREG-12457; VALUE: 3.3V
U4 = ST Microelctronics_By_element14_Batch_1:STM32F103CBT6: Medium-density performance line ARM-based 32-bit MCU; MPN: STM32F103CBT6; OC_FARNELL: 1606327; OC_NEWARK: 11N8296; PACKAGE: QFP-48; SUPPLIER: STMICROELECTRONICS
U5 = Brunez:MAX3485AEASA+; MANUFACTURER_PART_NUMBER: MAX3485AEASA+; VENDOR: Maxim Integrated Products
U$1 U$3 = SparkFun-Sensors:ACS712: ACS712 Hall-effect-based isolated linear current sensor Datasheet <http://www.sparkfun.com/datasheets/BreakoutBoards/0712.pdf> SparkFun Products SparkFun Low Current Sensor Breakout - ACS712 <https://www.sparkfun.com/products/8883> (SEN-08883); PROD_ID: IC-08964
U$2 U$5 = silicon-labs:SI8441: Si8441 4 Channel (3/1) Digital Isolator Silicon Labs Si84xx ISOpro digital isolator series. The Si84xx ISOpro digital isolators provide low power galvanic isolation for digital signals. The '41 has three forward and one reverse channel, with output enables. This part is suitable for four wire SPI: unidirectional signals with clock and chip select. They come in speeds of 1Mbps and 150Mbps, and isolation ratings of 1KV, 2.5KV and 5KV. The independent sides use 2.7-5.5V supplies and draw under 5mA per channel. Donald Becker
U$4 = meanwell_irm_v7:IRM_15/20: 15 or 20 watt housing & pin compatible IRM 15 Vout [V] Imax [A] Pmax [W] Eff [%] 3.3 3.5 11.55 74 5 3 15 78 12 1.25 15 82 15 1 15 82 24 0.63 15.12 83 IRM 20 Vout [V] Imax [A] Pmax [W] Eff [%] 3.3 4.5 14.85 76 5 4 20 79 12 1.8 21.6 84 15 1.4 21.6 84 24 0.9 21.6 85
U$6 = mastrogippo:ISOLATED_2P
U$7 = mastrogippo:OSHW-LOGO: Open Source Hardware Logo This logo indicates the piece of hardware it is found on incorporates a OSHW license and/or adheres to the definition of open source hardware found here: http://freedomdefined.org/OSHW
Y1 Y2 = SparkFun-Clocks:CRYSTAL: Crystals (Generic) These are passive quartz crystals, which can be used as a clock source for a microcontroller. Crystal's are two-terminal devices. They require external "load" capacitors to generate an oscillating signal.

## Net classes
1 pwr: width 0.305 mm, drill 0.356 mm, clearance 0.152 mm
2 analog: width 0.305 mm, drill 0.33 mm, clearance 0.152 mm